# EasyEDA Pro project ProPrj_Rak11310v3b_2025-04-18.epro, board PCB1
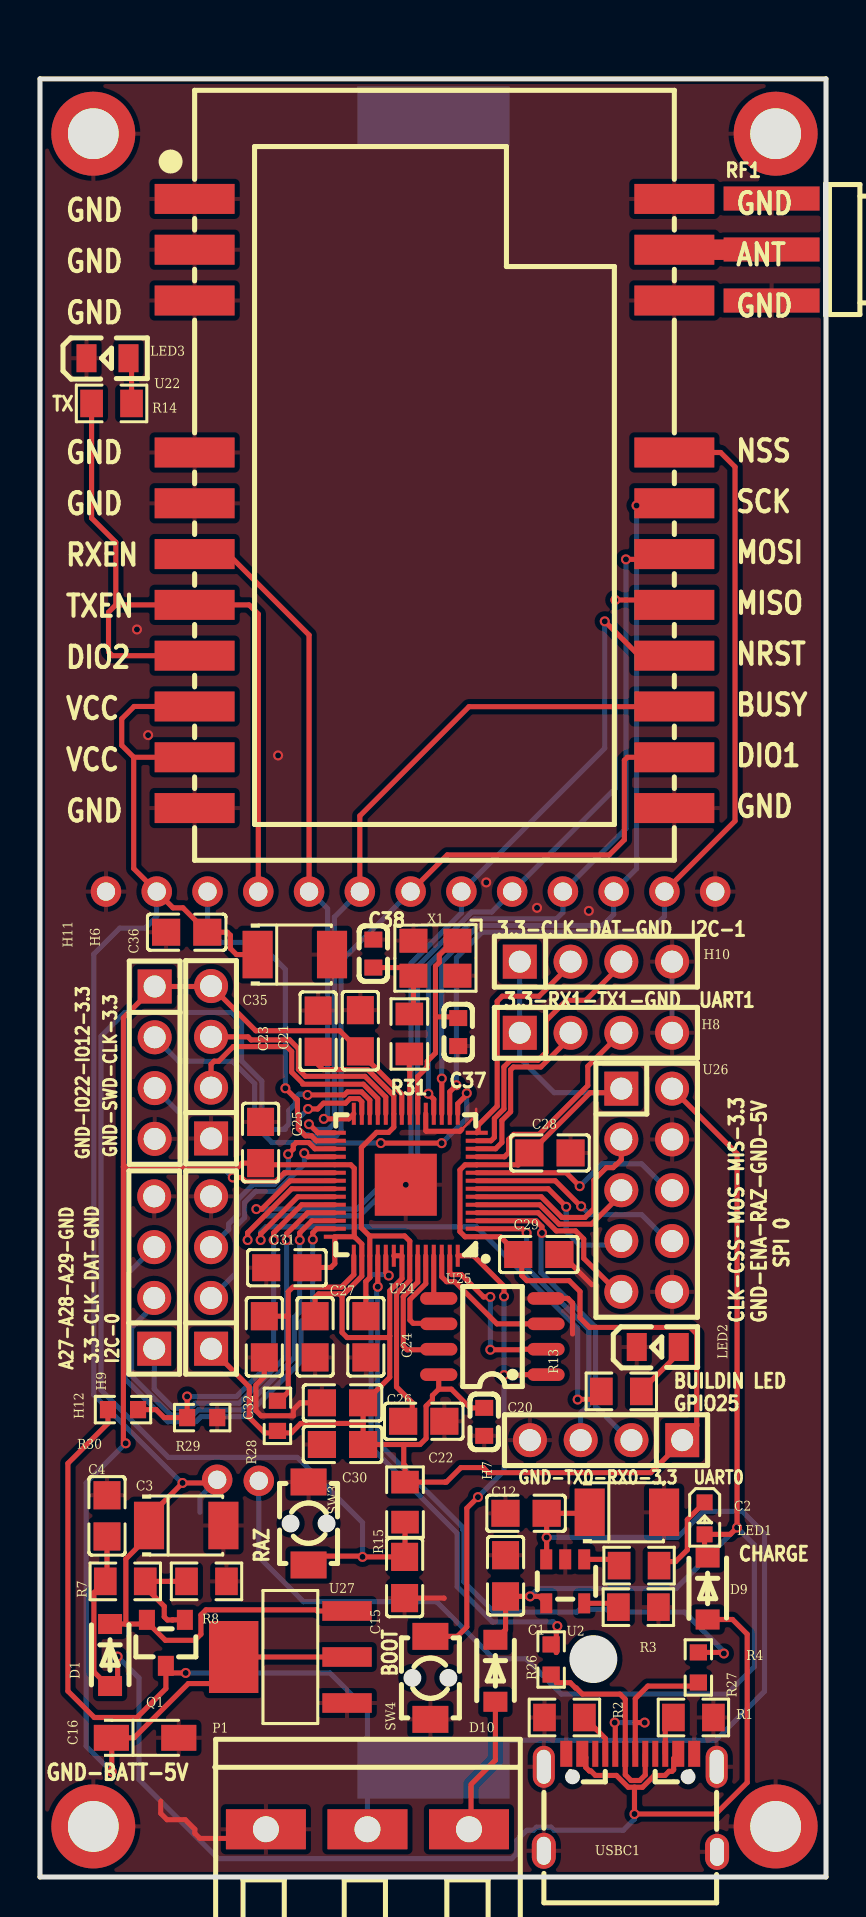
[diagram p1: board, top side]
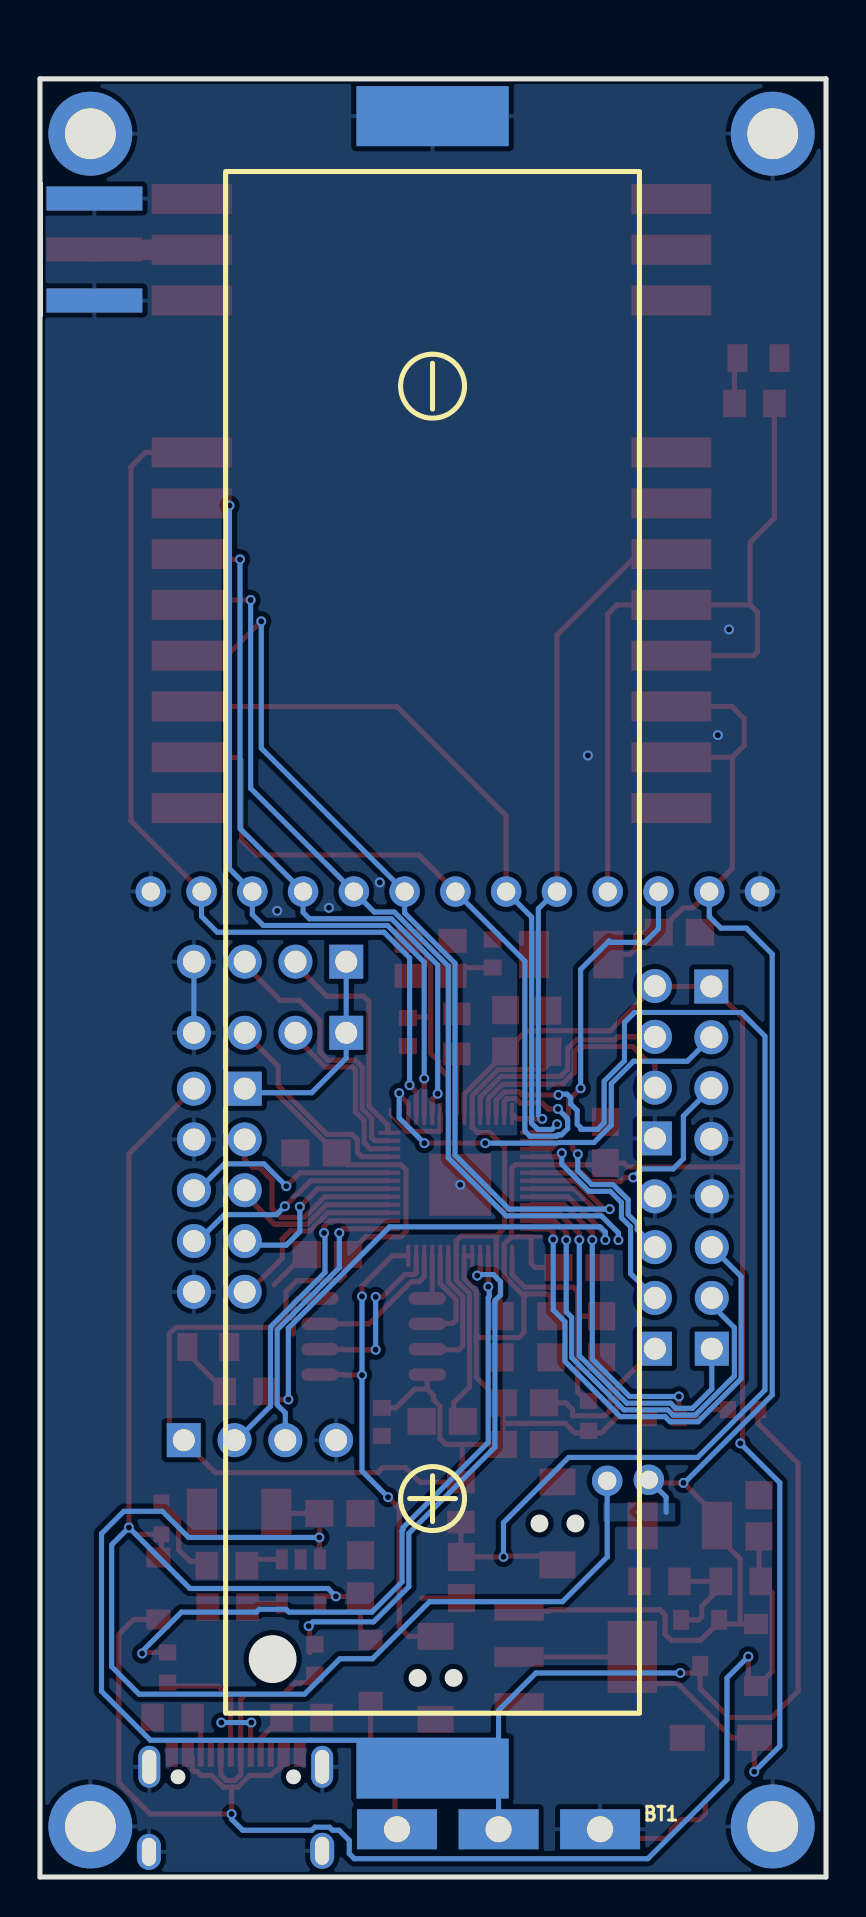
[diagram p2: board, bottom side, seen from below]

Outline 39.32 x 89.92 mm; copper layers: Top Layer, Bottom Layer. Coordinates in mm from the lower left corner of the outline.
Outline path: 0,89.92 0,0 39.32,0 39.32,89.92 0,89.92
Stack: Top Layer 0.035mm / Dielectric1 1.51mm FR4 er 4.5 / Bottom Layer 0.035mm

## Design rules (mm)
template: Custom Config
spacing copperThickness1oz (default): track to track 0.08, other pairs 0.08 to 0.3
spacing copperThickness2oz: track to track 0.203, other pairs 0.152 to 0.3
track width copperThickness1oz (default): min 0.08, default 0.254, max 2.54
track width copperThickness2oz: min 0.203, default 0.254, max 2.54
differential pair differentialPair (default): width min 0.127, default 0.254, max 2.54; gap min 0.152, default 0.152
via viaSize (default): diameter min 0.5, default 0.61, max 10; hole min 0.3, default 0.305, max 6.3

## Placement (name value [footprint] x y rotation side)
BT1  BH-18650-B1BA002  [BATTERY-SMD_18650-1S-L77.1-W20.7-1]  19.69 46.74 0 bottom
C1  1uF  [C0805]  23.29 15.06 270 top
C2  100uF  [CASE-B_3528]  29.36 18.24 0 top
C3  100uF  [CASE-B_3528]  7.32 17.58 0 top
C4  1uF  [C0805]  3.35 18.06 270 top
C12  100nF  [C0805]  24.32 18.19 0 top
C15  100nF  [C0805]  18.24 14.98 90 top
C16  10uF  [CAP-SMD_L3.2-W1.6-RD-C7171]  5.26 6.96 0 top
C20  1uF  [C0603]  22.23 22.76 270 top
C21  100nF  [C0805]  16.03 42.32 270 top
C22  100nF  [C0805]  19.2 22.79 180 top
C23  100nF  [C0805]  13.92 42.29 270 top
C24  100nF  [C0805]  16.3 27.01 90 top
C25  100nF  [C0805]  11.04 36.73 270 top
C26  100nF  [C0805]  15.14 23.71 0 top
C27  100nF  [C0805]  13.76 27.01 90 top
C28  100nF  [C0805]  25.51 36.21 180 top
C29  100nF  [C0805]  24.95 31.13 180 top
C30  100nF  [C0805]  15.14 21.63 0 top
C31  100nF  [C0805]  12.35 30.47 0 top
C32  100nF  [C0805]  11.22 27.01 90 top
C35  100uF  [CASE-B_3528]  12.75 46.13 0 top
C36  100nF  [C0805]  7.34 47.24 180 top
C37  15pF  [C0603]  20.92 42.25 270 top
C38  15pF  [C0603]  16.68 46.17 270 top
D1  MBR140SFT1G  [SOD-123F_L2.8-W1.8-LS3.7-RD]  3.51 11.1 270 top
D9  MBR140SFT1G  [SOD-123F_L2.8-W1.8-LS3.7-RD]  33.4 14.43 270 top
D10  MBR140SFT1G  [SOD-123F_L2.8-W1.8-LS3.7-RD]  22.78 10.31 270 top
H6  PZ254V-11-04P  [HDR-TH_4P-P2.54-V-M]  8.56 40.74 90 top
H7  PZ254V-11-04P  [HDR-TH_4P-P2.54-V-M]  28.32 21.84 180 top
H8  PZ254V-11-04P  [HDR-TH_4P-P2.54-V-M]  27.81 42.22 0 top
H9  PZ254V-11-04P  [HDR-TH_4P-P2.54-V-M]  8.56 30.23 90 top
H10  PZ254V-11-04P  [HDR-TH_4P-P2.54-V-M]  27.81 45.77 0 top
H11  PZ254V-11-04P  [HDR-TH_4P-P2.54-V-M]  5.74 40.72 270 top
H12  PZ254V-11-04P  [HDR-TH_4P-P2.54-V-M]  5.72 30.23 90 top
LED1  KT-0603R  [LED0603-RD]  33.25 17.93 270 top
LED2  KT-0805G  [LED0805-R-RD]  30.91 26.5 0 top
LED3  KT-0805B  [LED0805-R-RD]  3.38 75.95 0 top
NOREF  -  [Pad_e1183]  31.24 49.28 0 top
NOREF#2  -  [Pad_e4089]  2.67 2.53 0 top
NOREF#3  -  [Pad_e1184]  33.78 49.28 0 top
NOREF#4  -  [Pad_e1176]  10.92 49.28 0 top
NOREF#5  -  [Pad_e1035]  8.38 49.28 0 top
NOREF#6  -  [Pad_e1180]  23.62 49.28 0 top
NOREF#7  -  [Pad_e1179]  21.08 49.28 0 top
NOREF#8  -  [Pad_e4088]  36.8 2.53 0 top
NOREF#9  -  [Pad_e4085]  2.67 87.17 0 top
NOREF#10  -  [Pad_e4087]  36.8 87.17 0 top
NOREF#11  -  [Pad_e3351]  10.95 19.81 0 top
NOREF#12  -  [Pad_e1182]  28.7 49.28 0 top
NOREF#13  -  [Pad_e1173]  3.3 49.28 0 top
NOREF#14  -  [Pad_e1181]  26.16 49.28 0 top
NOREF#15  -  [Pad_e1174]  5.84 49.28 0 top
NOREF#16  -  [Pad_e2962]  8.86 19.86 0 top
NOREF#17  -  [Pad_e1178]  18.54 49.28 0 top
NOREF#18  -  [Pad_e1177]  16 49.28 0 top
NOREF#19  -  [Pad_e1175]  13.46 49.28 0 top
P1  WJ500V-5.08-3P  [CONN-TH_3P-P5.00_WJ500V-5.08-3P]  16.38 2.39 0 top
Q1  AO3401A  [SOT-23_L2.9-W1.3-P1.90-LS2.4-BR]  6.3 11.71 90 top
R1  4.7kΩ  [R0805]  32.69 7.98 180 top
R2  4.7kΩ  [R0805]  26.24 7.98 0 top
R3  2.7kΩ  [R0805]  29.94 13.5 180 top
R4  1kΩ  [R0805]  29.97 15.57 0 top
R7  1kΩ  [R0805]  4.27 14.78 180 top
R8  10kΩ  [R0805]  8.33 14.78 180 top
R13  4.7kΩ  [R0805]  29.08 24.28 180 top
R14  4.7kΩ  [R0805]  3.58 73.69 180 top
R15  10kΩ  [R0805]  18.26 18.75 90 top
R26  27Ω  [R0603]  25.57 10.88 270 top
R27  27Ω  [R0603]  32.94 10.48 270 top
R28  200Ω  [R0603]  11.88 23.06 90 top
R29  100kΩ  [R0603]  8.12 22.97 0 top
R30  200kΩ  [R0603]  4.15 23.37 180 top
R31  1kΩ  [R0805]  18.48 42.16 90 top
RF1  BWSMA-KE-P001  [SMA-SMD_BWSMA-KE-P001]  36.6 81.38 0 top
SW3  TSA343G00D-250J2  [SW-SMD_L4.0-W2.9-P4.15-EH]  13.44 17.68 270 top
SW4  TSA343G00D-250J2  [SW-SMD_L4.0-W2.9-P4.15-EH]  19.53 9.96 90 top
U2  TP4054  [SOT-23-5_L2.9-W1.6-P0.95-LS2.8-BR]  26.28 14.78 90 top
U22  E22-900M30S  [WIRELM-SMD_E22-900M30S]  19.74 68.68 180 top
U24  RP2040  [LQFN-56_L7.0-W7.0-P0.4-EP]  18.3 34.62 180 top
U25  W25Q16JVSNIQ  [SOP-8_L4.9-W3.9-P1.27-LS6.0-BL]  22.63 27.03 90 top
U26  ZX-PZ2.54-2-5PZZ  [HDR-TH_10P-P2.54-V-M-R2-C5-S2.54]  30.35 34.34 270 top
U27  AMS1117-3.3  [SOT-223-4_L6.5-W3.5-P2.30-LS7.0-BR]  12.53 11 0 top
USBC1  918-418K2023S40001  [USB-C-SMD_TYPE-C-USB-17]  29.54 3.71 0 top
X1  12MHz  [OSC-SMD_4P-L3.2-W2.5-BL]  19.78 45.94 180 top

## Footprints (pads in the part's own frame, mm; a bottom-side part is the same pattern mirrored in y, then rotated)
BATTERY-SMD_18650-1S-L77.1-W20.7-1
  rect 7.62x3 smd: 1(0,-41.313) 2(0,41.313)
C0603
  rect 0.8x0.9 smd: 1(-0.7,0) 2(0.7,0)
C0805
  rect 1.41x1.35 smd: 1(-1.03,0) 2(1.03,0)
CAP-SMD_L3.2-W1.6-RD-C7171
  rect 1.758x1.296 smd: 1(-1.687,0) 2(1.687,0)
CASE-B_3528
  rect 1.506x2.376 smd: 1(-1.861,0) 2(1.861,0)
CONN-TH_3P-P5.00_WJ500V-5.08-3P
  rect 4x2 hole 1.3: 1(-5.08,0) 2(0,0) 3(5.08,0)
HDR-TH_4P-P2.54-V-M
  rect 1.7x1.7 hole 1.1: 1(-3.81,0)
  round 1.7 hole 1.1: 2(-1.27,0) 3(1.27,0) 4(3.81,0)
HDR-TH_10P-P2.54-V-M-R2-C5-S2.54
  rect 1.7x1.7 hole 1.1: 1(-5.08,-1.27)
  round 1.7 hole 1.1: 2(-5.08,1.27) 3(-2.54,-1.27) 4(-2.54,1.27) 5(0,-1.27) 6(0,1.27) 7(2.54,-1.27) 8(2.54,1.27) 9(5.08,-1.27) 10(5.08,1.27)
LED0603-RD
  rect 0.8x0.8 smd: 1(-0.799,0) 2(0.799,0)
LED0805-R-RD
  rect 1x1.399 smd: 1(1.05,0) 2(-1.05,0)
LQFN-56_L7.0-W7.0-P0.4-EP
  rect 1.1x0.2 smd: 1(-3.55,2.6) 2(-3.55,2.2) 3(-3.55,1.8) 4(-3.55,1.4) 5(-3.55,1) 6(-3.55,0.6) 7(-3.55,0.2) 8(-3.55,-0.2) 9(-3.55,-0.6) 10(-3.55,-1) 11(-3.55,-1.4) 12(-3.55,-1.8) 13(-3.55,-2.2) 14(-3.55,-2.6) 29(3.55,-2.6) 30(3.55,-2.2) 31(3.55,-1.8) 32(3.55,-1.4) 33(3.55,-1) 34(3.55,-0.6) 35(3.55,-0.2) 36(3.55,0.2) 37(3.55,0.6) 38(3.55,1) 39(3.55,1.4) 40(3.55,1.8) 41(3.55,2.2) 42(3.55,2.6)
  rect 0.2x1.1 smd: 15(-2.6,-3.55) 16(-2.2,-3.55) 17(-1.8,-3.55) 18(-1.4,-3.55) 19(-1,-3.55) 20(-0.6,-3.55) 21(-0.2,-3.55) 22(0.2,-3.55) 23(0.6,-3.55) 24(1,-3.55) 25(1.4,-3.55) 26(1.8,-3.55) 27(2.2,-3.55) 28(2.6,-3.55) 43(2.6,3.55) 44(2.2,3.55) 45(1.8,3.55) 46(1.4,3.55) 47(1,3.55) 48(0.6,3.55) 49(0.2,3.55) 50(-0.2,3.55) 51(-0.6,3.55) 52(-1,3.55) 53(-1.4,3.55) 54(-1.8,3.55) 55(-2.2,3.55) 56(-2.6,3.55)
  rect 3.1x3.1 smd: 57(0,0)
OSC-SMD_4P-L3.2-W2.5-BL
  rect 1.4x1.2 smd: 1(-1.1,-0.875) 2(1.1,-0.875) 3(1.1,0.875) 4(-1.1,0.875)
Pad_e1035
  round 1.524 hole 0.914: 1(0,0)
Pad_e1173
  round 1.524 hole 0.914: 1(0,0)
Pad_e1174
  round 1.524 hole 0.914: 2(0,0)
Pad_e1175
  round 1.524 hole 0.914: 3(0,0)
Pad_e1176
  round 1.524 hole 0.914: 4(0,0)
Pad_e1177
  round 1.524 hole 0.914: 5(0,0)
Pad_e1178
  round 1.524 hole 0.914: 6(0,0)
Pad_e1179
  round 1.524 hole 0.914: 7(0,0)
Pad_e1180
  round 1.524 hole 0.914: 8(0,0)
Pad_e1181
  round 1.524 hole 0.914: 9(0,0)
Pad_e1182
  round 1.524 hole 0.914: 10(0,0)
Pad_e1183
  round 1.524 hole 0.914: 11(0,0)
Pad_e1184
  round 1.524 hole 0.914: 12(0,0)
Pad_e2962
  round 1.524 hole 0.914: 1(0,0)
Pad_e3351
  round 1.524 hole 0.914: 1(0,0)
Pad_e4085
  round 4.2 hole 2.54: 45(0,0)
Pad_e4087
  round 4.2 hole 2.54: 45(0,0)
Pad_e4088
  round 4.2 hole 2.54: 45(0,0)
Pad_e4089
  round 4.2 hole 2.54: 45(0,0)
R0603
  rect 0.806x0.864 smd: 1(-0.753,0) 2(0.753,0)
R0805
  rect 1.133x1.377 smd: 1(-1,0) 2(1,0)
SMA-SMD_BWSMA-KE-P001
  rect 4.8x1.2 smd: 1(0,-2.55) 2(0,2.55) 5(0,0)
  rect 4.8x1.2 smd far side: 3(0,2.55) 4(0,-2.55)
SOD-123F_L2.8-W1.8-LS3.7-RD
  rect 1x1.2 smd: 1(-1.55,0) 2(1.55,0)
SOP-8_L4.9-W3.9-P1.27-LS6.0-BL
  oval 0.63x1.865 smd: 1(-1.905,-2.683) 2(-0.635,-2.683) 3(0.635,-2.683) 4(1.905,-2.683) 5(1.905,2.683) 6(0.635,2.683) 7(-0.635,2.683) 8(-1.905,2.683)
SOT-23-5_L2.9-W1.6-P0.95-LS2.8-BR
  rect 1x0.6 smd: 1(1.1,-0.95) 2(1.1,0) 3(1.1,0.95) 4(-1.1,0.95) 5(-1.1,-0.95)
SOT-23_L2.9-W1.3-P1.90-LS2.4-BR
  rect 1x0.8 smd: 1(1.15,-0.95) 2(1.15,0.95) 3(-1.15,0)
SOT-223-4_L6.5-W3.5-P2.30-LS7.0-BR
  rect 2.47x0.98 smd: 1(2.835,-2.3) 2(2.835,0) 3(2.835,2.3)
  rect 2.47x3.6 smd: 4(-2.835,0)
SW-SMD_L4.0-W2.9-P4.15-EH
  rect 1.35x1.8 smd: 1(-2.075,0) 2(2.075,0)
USB-C-SMD_TYPE-C-USB-17
  oval 1.1x2.1 hole 0.7x1.7: 0(-4.334,1.802) 0(4.316,1.802)
  oval 1.2x1.8 hole 0.7x1.4: 0(-4.334,-2.398) 0(4.334,-2.453)
  rect 0.6x1.3 smd: A1(-3.209,2.451) A4(-2.409,2.451) A9(2.391,2.452) A12(3.191,2.451)
  rect 0.3x1.3 smd: A5(-1.259,2.451) A6(-0.259,2.451) A7(0.241,2.451) A8(1.24,2.453) B5(1.741,2.451) B6(0.741,2.451) B7(-0.759,2.451) B8(-1.759,2.453)
WIRELM-SMD_E22-900M30S
  rect 4x1.5 smd: 1(12,-15.23) 2(12,-12.69) 3(12,-10.15) 4(12,-2.55) 5(12,-0.01) 6(12,2.53) 7(12,5.07) 8(12,7.61) 9(12,10.15) 10(12,12.69) 11(12,15.23) 12(-12,15.23) 13(-12,12.69) 14(-12,10.15) 15(-12,7.61) 16(-12,5.07) 17(-12,2.53) 18(-12,-0.01) 19(-12,-2.55) 20(-12,-10.15) 21(-12,-12.69) 22(-12,-15.23)

## Nets
1V1: C22.2 C23.2 C24.2 U24.23 U24.45 U24.50
3.3V: C16.1 C20.1 C21.2 C25.2 C26.2 C27.2 C28.2 C29.2 C30.2 C31.2 H6.4 H7.1 H8.1 H9.1 H10.1 H11.1 R15.2 R28.1 U24.1 U24.10 U24.22 U24.33 U24.42 U24.44 U24.48 U24.49 U25.8 U26.1 U27.2 U27.4
+5V: C1.2 D9.1 D10.1 LED1.2 NOREF#11.1 U2.4 U26.2
GND: BT1.1 C1.1 C2.2 C3.2 C4.1 C12.1 C15.1 C16.2 C20.2 C21.1 C22.1 C23.1 C24.1 C25.1 C26.1 C27.1 C28.1 C29.1 C30.1 C31.1 C32.1 C35.2 C36.2 C37.2 C38.1 H6.1 H7.4 H8.4 H9.4 H10.4 H11.4 H12.4 LED2.2 LED3.2 NOREF#2.45 NOREF#3.12 NOREF#8.45 NOREF#9.45 NOREF#10.45 NOREF#13.1 P1.1 R1.1 R2.1 R3.1 R8.1 R29.2 RF1.1 RF1.2 RF1.3 RF1.4 SW3.1 SW4.1 U2.2 U22.1 U22.2 U22.3 U22.4 U22.5 U22.11 U22.12 U22.20 U22.22 U24.19 U24.57 U25.4 U26.4 U26.10 U27.1 USBC1.0 USBC1.A1 USBC1.A12 X1.2 X1.4
VCC: C3.1 C35.1 C36.1 D1.1 NOREF#15.2 NOREF#16.1 Q1.2 U22.9 U22.10 U27.3
ADC1-GPIO27: H12.1 U24.39
ADC2-GPIO28: H12.2 U24.40
ADC3-GPIO29: H12.3 U24.41
BUSY: NOREF#18.5 U22.14 U24.29
DIO1: NOREF#17.6 U22.13 U24.27
GPIO12: H11.2 U24.15
GPIO19: NOREF#5.1 U24.30
GPIO22: H11.3 U24.34
I2C0-CLK: H9.2 U24.32
I2C0-DAT: H9.3 U24.31
I2C1-CLK: H10.2 U24.14
I2C1-DAT: H10.3 U24.13
LED1: R13.2 U24.37
MISO: NOREF#6.8 U22.16 U24.36
MOSI: NOREF#14.9 U22.17 U24.18
NRST: NOREF#7.7 U22.15 U24.35
NSS: NOREF.11 U22.19 U24.16
QSPI_SCLK: U24.52 U25.6
QSPI_SD0: U24.53 U25.5
QSPI_SD1: U24.55 U25.2
QSPI_SD2: U24.54 U25.3
QSPI_SD3: U24.51 U25.7
QSPI_SS_N: SW4.2 U24.56 U25.1
RESET: C15.2 R15.1 SW3.2 U24.26
RXEN: NOREF#19.3 U22.6 U24.28
SCK: NOREF#12.10 U22.18 U24.17
SPI0-CLK: U24.4 U26.9
SPI0-CS-SS: U24.7 U26.7
SPI0-ENABLE: U24.8 U26.8
SPI0-MISO-RX: U24.6 U26.3
SPI0-MOSI-TX: U24.5 U26.5
SPI0-RESET: U24.9 U26.6
TXEN: NOREF#4.4 R14.2 U22.7 U22.8
UART0-RX: H7.2 U24.3
UART0-TX: H7.3 U24.2
UART1-RX: H8.2 U24.12
UART1-TX: H8.3 U24.11
USB+: R26.2 USBC1.A6 USBC1.B6
USB-: R27.2 USBC1.A7 USBC1.B7
VUSB: C4.2 D1.2 D9.2 R7.2 USBC1.A4 USBC1.A9
$2N12498: C37.1 U24.20 X1.1
$2N12725: R26.1 U24.47
$2N12727: R27.1 U24.46
$2N13721: C32.2 R28.2 U24.43
$2N13936: H6.2 U24.25
$2N13938: H6.3 U24.24
$2N15293: R29.1 R30.1 U24.38
$2N20056: R2.2 USBC1.A5
$2N20057: R1.2 USBC1.B5
$2N20240: LED3.1 R14.1
$2N20242: LED2.1 R13.1
$2N21416: R4.1 U2.1
$2N21417: LED1.1 R4.2
$2N21420: Q1.1 R7.1 R8.2
$2N21421: R3.2 U2.5
$2N21422: BT1.2 C2.1 C12.2 P1.2 Q1.3 R30.2 U2.3
$2N21423: D10.2 P1.3
$2N36053: C38.2 R31.2 X1.3
$2N36055: R31.1 U24.21
$2N36215: RF1.5 U22.21

Pads without a net: USBC1 A8 B8

## Via types
v1: diameter 0.5, hole 0.3, Top Layer to Bottom Layer, 60 vias

## Routing (per net, layer and track width the routed paths; a pad name or vN(x,y) marks a point on that pad's centre or on a via; arc(x,y) is an arc through that point)
1V1: length 28.7
  Top Layer w0.256: 18.63,22.79 18.63,23.72 17.84,24.51 17.84,29.17 18.5,29.84 U24.50 18.5,31.8 18.24,32.06 16.5,32.06 ; C24.2 16.3,29.77 16.5,29.97 U24.45 16.5,32.06 ; 16.5,32.06 16.48,32.06 16.08,32.46 16.08,36.47 16.84,37.24 17.44,37.24 17.7,37.49 U24.23 17.7,39.07 16.4,40.37 14.16,40.37 13.83,40.71 ; 13.83,41.26 13.92,41.26
3.3V: length 192.5
  Top Layer w0.256: 16.17,22.68 C26.2 16.22,23.71 17.5,24.99 17.5,27.05 ; 16.17,22.68 C30.2 18.2,21.63 ; 16.17,22.68 13.04,22.68 12.57,22.21 11.25,22.21 10.46,23 10.47,23.01 10.47,24.51 H9.1 ; C31.2 13.39,30.48 14.55,30.48 14.75,30.68 U24.42 15.73,32.02 ; 18.2,21.63 19.01,21.63 19.32,21.93 19.32,23.55 19.63,23.87 19.63,24.08 19.95,24.39 ; 18.2,21.63 18.2,20.63 18.26,20.57 R15.2 20.27,19.75 20.27,19.75 20.33,19.75 21.06,20.47 22.17,20.47 22.17,20.48 22.43,20.22 30.56,20.22 31.67,21.34 31.67,21.39 32.86,22.57 32.86,27.15 32.53,27.48 27.5,27.48 27.02,27.96 27.02,29.28 26.47,29.82 24.36,29.82 24.1,30.07 24.1,30.95 23.04,32.02 U24.1 21.27,32.02 21.01,32.27 21.01,35.36 21.27,35.61 21.85,35.61 U24.10 23.91,35.62 23.92,35.6 ; C28.2 24.51,36.21 27.52,39.22 29.08,39.22 ; 16.03,40.73 16.52,40.73 18.1,39.15 U24.22 ; C27.2 13.76,28.98 13.94,29.16 14.98,29.16 ; 4.17,35.51 9.92,35.51 10.11,35.7 C25.2 ; 4.17,35.51 4.17,21.8 v1(4.29,21.69) ; 4.17,35.51 4.17,42.96 H11.1 8.54,44.53 H6.4 10.8,42.32 15,42.32 C21.2 ; C20.1 21.52,23.46 20.58,24.39 19.95,24.39 ; 19.95,24.39 U25.8 ; 14.98,29.16 15.21,29.16 16.1,30.05 U24.44 16.1,31.65 15.73,32.02 ; 14.98,29.16 15.11,29.02 15.11,27.23 15.37,26.98 17.42,26.98 17.5,27.05 ; 17.5,27.05 17.5,29.31 18.11,29.92 18.11,31.07 U24.48 ; 15.73,32.02 15.72,32.03 15.72,35.44 15.55,35.62 U24.33 11.42,35.62 11.09,35.95 ; U27.2 U27.4 9.69,10.02 9.34,9.67 7.42,9.67 4.71,6.96 C16.1 3.59,6.94 v1(3.59,5.26)
  Bottom Layer w0.256: 29.08,39.22 25.73,39.22 24,40.95 H8.1 24,45.62 ; v1(3.59,5.26) 2.31,6.54 2.31,19.71 v1(4.29,21.69)
+5V: length 82.2
  Top Layer w0.256: D10.1 23.29,12.37 C1.2 v1(24.52,14.03) 24.98,14.03 U2.4 ; U26.2 34.87,36.17 v1(34.87,17.48) 34.53,17.13 LED1.2 33.25,15.72 33.3,15.67
  Bottom Layer w0.256: v1(24.52,14.03) 24.92,14.43 31.83,14.43 v1(34.87,17.48) 35.74,16.61 35.74,10.52 34.37,9.14 26.09,9.14 24.32,10.91 22.69,10.91 19.84,13.77 13.18,13.77 10.95,16 NOREF#11.1
GND: length 25.9
  Top Layer w0.128: 21.11,37.39 21.82,38.1 21.82,38.41
  Top Layer w0.256: C32.1 11.22,25.02 10.81,24.6 10.81,23.32 11.06,23.06 12.67,23.06 12.67,23.37 13.02,23.71 C26.1 ; 6.04,3.79 6.04,3.18 6.36,2.86 7.27,2.86 7.75,2.39 7.75,2.18 8,1.93 9.38,1.93 ; 27.61,29.62 26.1,31.13 C29.1 ; 21.11,37.39 21.01,37.29 19.33,37.29 19.3,37.32 U24.19 ; 20.22,13.94 20.21,13.95 C15.1 ; U25.4 26.42,28.93 26.64,28.7 26.64,27.15
  Bottom Layer w0.256: 31.62,45.62 H8.4
  vias: v1(4.85,62.38) v1(5.41,57.1) v1(11.91,56.08) v1(18.3,34.62) v1(22.33,49.73) v1(24.87,48.46) v1(27.46,48.31)
VCC: length 82.3
  Top Layer w0.256: 5.51,49.28 5.51,49.61 4.69,50.43 4.69,55.99 ; 5.45,17.63 5.45,18.03 v1(7.13,19.7) 8.6,19.7 8.82,19.92 8.82,19.91 NOREF#16.1 ; 5.45,17.63 C3.1 ; 5.45,17.63 5.16,17.63 4.98,17.45 4.98,16.58 4.3,15.9 4.3,12.65 ; U22.9 4.71,58.53 4.09,57.91 4.09,56.59 4.69,55.99 ; U27.3 13.87,13.3 13.81,13.36 8.31,13.36 8.05,13.11 8.05,12.14 7.75,11.84 6.27,11.84 5.35,12.76 Q1.2 5.14,12.65 4.3,12.65 ; C35.1 9.83,46.13 9.52,46.43 9.52,47.09 9.37,47.24 C36.1 7.15,48.46 6.66,48.46 NOREF#15.2 ; 4.69,55.99 7.74,55.99 ; D1.1 4.3,12.65
  Bottom Layer w0.256: NOREF#16.1 8,19 8,18.24 ; NOREF#15.2 5.84,48.03 5.26,47.45 3.99,47.45 2.69,46.15 2.69,24.11 7.11,19.69
ADC1-GPIO27: length 19.1
  Top Layer w0.256: v1(12.34,31.85) 12.34,32.17 13.39,33.22 U24.39
  Bottom Layer w0.256: H12.1 5.72,24.4 6.68,23.44 7.52,23.44 7.78,23.69 9.97,23.69 12.34,26.07 v1(12.34,31.85)
ADC2-GPIO28: length 22.9
  Top Layer w0.256: v1(13,31.85) 13,32.21 13.6,32.82 U24.40
  Bottom Layer w0.256: 5.72,28.96 5.72,28.6 4.58,27.47 4.58,25.06 6.54,23.1 7.66,23.1 7.92,23.36 10.11,23.36 12.73,25.97 12.73,27.99 13,28.26 v1(13,31.85)
ADC3-GPIO29: length 26
  Top Layer w0.256: v1(13.65,31.88) 13.65,32.22 13.85,32.42 U24.41
  Bottom Layer w0.256: v1(13.65,31.88) 13.65,28.36 13.06,27.77 13.06,25.79 10.3,23.02 8.05,23.02 7.8,22.76 6.4,22.76 4.25,24.92 4.25,30.03 H12.3
BUSY: length 36.6
  Top Layer w0.256: 31.44,58.52 21.46,58.52 16,53.06 NOREF#18.5 ; U24.29 13.9,37.22 13.47,37.64 v1(13.45,37.64)
  Bottom Layer w0.256: NOREF#18.5 14.73,48 14.73,37.69 14.42,37.38 13.72,37.38 v1(13.45,37.64)
DIO1: length 38.9
  Top Layer w0.256: v1(13.41,38.41) 13.89,38.41 14.18,38.7 15.29,38.7 15.51,38.92 15.95,38.92 16.1,38.77 U24.27 ; NOREF#17.6 20.37,51.11 28.48,51.11 29.24,51.87 29.24,55.84 29.39,55.99 31.74,55.99
  Bottom Layer w0.256: NOREF#17.6 15.06,45.8 15.06,37.3 14.81,37.05 13.48,37.05 13.41,37.11 13.24,37.11 12.92,37.42 12.92,37.86 12.94,37.88 12.94,37.94 v1(13.41,38.41)
GPIO12: length 21.9
  Top Layer w0.256: v1(17.05,36.7) 20.09,36.7 v1(20.09,36.7) ; v1(21.35,39.19) 21.35,39.12 20.9,38.67 20.9,38.17
  Bottom Layer w0.256: v1(21.35,39.19) 21.35,37.96 v1(20.09,36.7) ; H11.2 6.94,40.79 9.63,40.79 10.74,39.68 10.74,37.59 11.61,36.73 13.36,36.73 ; v1(17.05,36.7) 13.47,36.7
GPIO19: length 17
  Top Layer w0.256: U24.30 13.83,36.82 13.58,37.06 13.29,37.06 12.92,37.42 12.92,38.14 12.88,38.19 12.88,38.86 12.86,38.89 12.83,38.89 v1(12.28,39.44)
  Bottom Layer w0.256: NOREF#5.1 8.38,47.42 9.07,46.74 10.77,46.74 10.85,46.81 12.28,45.38 v1(12.28,39.44)
GPIO22: length 12.4
  Top Layer w0.256: U24.34 12.23,35.22 11.8,34.79 10.27,34.79 10.08,34.98 v1(9.65,34.98)
  Bottom Layer w0.256: v1(9.65,34.98) 9.22,35.41 7.65,35.41 7.14,35.92 7.14,38.05 H11.3
I2C0-CLK: length 11.4
  Top Layer w0.256: U24.32 13.4,36.02 v1(13.22,36.2)
  Bottom Layer w0.256: v1(13.22,36.2) 13.22,35.65 11.86,34.29 10.8,34.29 10.24,33.73 10.24,32.97 9.78,32.51 9.78,30.18 8.56,28.96
I2C0-DAT: length 9.7
  Top Layer w0.256: v1(12.42,36.15) 12.67,36.4 12.67,36.58 12.82,36.73 13.44,36.73 13.75,36.42 U24.31
  Bottom Layer w0.256: H9.3 9.44,32.38 9.44,32.66 9.9,33.12 9.9,33.87 10.66,34.63 11.72,34.63 12.42,35.32 12.42,36.14 v1(12.42,36.15)
I2C1-CLK: length 11.4
  Top Layer w0.256: 26.54,45.62 24.97,44.04 23.13,44.04 22.87,43.79 22.87,38.55 21.92,37.59 21.92,37.29 U24.14
I2C1-DAT: length 13.6
  Top Layer w0.256: U24.13 22.57,36.82 22.73,36.98 22.73,37.93 23.21,38.41 23.21,40.51 23.55,40.84 24.92,40.84 25.32,41.25 25.32,42.82 26.34,43.84 27.3,43.84 29.08,45.62
LED1: length 27.6
  Top Layer w0.256: 27.66,23.89 26.91,23.89 v1(26.9,23.88) ; U24.37 12.9,34.02 11.04,32.15 v1(11.04,31.85)
  Bottom Layer w0.256: v1(11.04,31.85) 11.04,32.25 11.3,32.51 21.83,32.51 26.9,27.45 v1(26.9,23.88)
MISO: length 51.7
  Top Layer w0.256: 31.74,63.61 31.49,63.86 v1(28.79,63.86) ; U24.36 12.59,34.42 10.39,32.21 v1(10.39,31.85)
  Bottom Layer w0.256: v1(28.79,63.86) 28.79,54.44 NOREF#6.8 22.6,48.25 21.6,48.25 18.9,45.55 18.9,35.96 16,33.06 11.24,33.06 10.39,32.21 v1(10.39,31.85)
MOSI: length 36.9
  Top Layer w0.256: v1(19.43,39.17) 19.7,38.89 U24.18 ; U22.17 31.47,65.89 v1(29.32,65.89)
  Bottom Layer w0.256: v1(19.43,39.17) 19.43,45.6 21.74,47.92 25.84,47.92 26.16,48.24 NOREF#14.9 29.32,52.43 v1(29.32,65.89)
NRST: length 48.3
  Top Layer w0.256: v1(10.82,33.4) 11.1,33.4 12.52,34.82 U24.35 ; v1(28.26,62.79) 29.97,61.07 31.74,61.07
  Bottom Layer w0.256: v1(10.82,33.4) 15.86,33.4 18.56,36.1 18.56,45.69 21.08,48.21 NOREF#7.7 28.26,56.45 v1(28.26,62.79)
NSS: length 46.5
  Top Layer w0.256: U22.19 34.05,71.23 34.77,70.51 34.77,52.81 NOREF.11 ; v1(20.83,39.59) 20.5,39.26 U24.16
  Bottom Layer w0.256: NOREF.11 31.24,48.03 30.45,47.24 22.11,47.24 20.83,45.96 v1(20.83,39.59)
QSPI_SCLK: length 4.3
  Top Layer w0.256: U24.52 19.3,29.67 18.51,28.88 18.51,27.85 18.67,27.69 19.18,27.69
QSPI_SD0: length 2.2
  Top Layer w0.256: U24.53 19.7,29.18 U25.5
QSPI_SD1: length 8.8
  Top Layer w0.256: U24.55 20.5,30.22 20.6,30.12 21.07,30.12 22.19,29.01 v1(22.53,29.01) ; v1(22.53,26.37) 24.1,26.37 24.13,26.39 U25.2
  Bottom Layer w0.256: v1(22.53,29.01) v1(22.53,26.37)
QSPI_SD2: length 7.2
  Top Layer w0.256: U24.54 20.1,30.01 20.35,29.77 20.75,29.77 22.86,27.66 U25.3
QSPI_SD3: length 5.8
  Top Layer w0.256: 19.13,26.37 18.36,26.37 18.17,26.56 18.17,29.02 18.9,29.75 18.9,31.07
QSPI_SS_N: length 24.9
  Top Layer w0.256: U25.1 24.13,25.12 24.1,25.1 v1(23.22,25.1) ; SW4.2 20.88,12.03 21.35,12.51 21.35,18.44 v1(21.91,19) ; 20.9,31.07 21.69,31.07 23.22,29.54 v1(23.22,29.03)
  Bottom Layer w0.256: v1(23.22,29.03) v1(23.22,25.1) 23.22,20.3 v1(21.91,19)
RESET: length 62.6
  Top Layer w0.256: R15.1 18.26,16.03 C15.2 v1(16.14,16.01) 16.1,16.05 13.59,16.05 ; U24.26 16.5,38.85 16.09,39.26 15.38,39.26 15.22,39.11 v1(13.39,39.11)
  Bottom Layer w0.256: v1(16.14,16.01) 16.14,17.72 12.88,20.98 6.43,20.98 3.05,24.35 3.05,42.04 4.24,43.23 9.58,43.23 10.08,42.72 10.08,40.81 11.1,39.79 11.1,37.71 11.42,37.39 12.27,37.39 12.27,37.46 12.45,37.64 12.45,38.33 12.78,38.66 12.78,38.96 12.96,39.15 13.35,39.15 v1(13.39,39.11)
RXEN: length 33.7
  Top Layer w0.256: v1(14.2,37.91) 15.45,37.91 U24.28 ; NOREF#19.3 13.46,62.1 9.41,66.15 U22.6
  Bottom Layer w0.256: NOREF#19.3 13.53,49.28 14.39,48.42 14.39,38.11 v1(14.2,37.91)
SCK: length 40
  Top Layer w0.256: 20.1,38.17 v1(20.1,39.93) ; v1(29.85,68.58) 31.62,68.58 31.74,68.69
  Bottom Layer w0.256: v1(29.85,68.58) 29.85,50.42 NOREF#12.10 28.7,48.13 28.15,47.58 21.94,47.58 20.1,45.74 v1(20.1,39.93)
SPI0-CLK: length 9.5
  Top Layer w0.256: 29.08,29.06 27.2,30.94 27.2,31.9 26.8,32.31 25.83,32.31 24.93,33.22 U24.4
SPI0-CS-SS: length 9.1
  Top Layer w0.256: U24.7 25.43,34.42 v1(26.33,33.52)
  Bottom Layer w0.256: 29.08,31.6 27,31.6 26.33,32.27 v1(26.33,33.52)
SPI0-ENABLE: length 11.1
  Top Layer w0.256: U24.8 25.77,34.82 27.05,33.54 v1(27.07,33.54)
  Bottom Layer w0.256: 31.62,31.6 30.1,33.12 27.49,33.12 v1(27.07,33.54)
SPI0-MISO-RX: length 10.5
  Top Layer w0.256: 29.08,36.68 29.08,35.87 28.83,35.61 28.81,35.61 28.67,35.47 28.33,35.47 27.71,34.85 27.71,33.43 27.27,32.98 26.11,32.98 25.08,34.02 U24.6
SPI0-MOSI-TX: length 8.3
  Top Layer w0.256: U24.5 25,33.62 25.97,32.65 27.59,32.65 29.08,34.14
SPI0-RESET: length 11.1
  Top Layer w0.256: v1(27,34.54) 26.33,35.22 U24.9
  Bottom Layer w0.256: 31.62,34.14 30.1,35.66 28.12,35.66 v1(27,34.54)
TXEN: length 38.7
  Top Layer w0.256: R14.2 2.58,67.95 3.79,66.74 3.79,63.61 ; 7.74,61.07 3.62,61.07 3.43,61.27 3.43,63.25 3.79,63.61 ; 3.79,63.61 10.46,63.61 10.92,63.15 NOREF#4.4
UART0-RX: length 16.1
  Top Layer w0.256: v1(25.11,32.2) 25.11,32.52 24.82,32.82 U24.3
  Bottom Layer w0.256: 29.59,21.74 27.79,23.54 27.79,27.5 25.06,30.23 25.06,32.15 v1(25.11,32.2)
UART0-TX: length 14.5
  Top Layer w0.256: U24.2 24.14,32.42 v1(24.35,32.2)
  Bottom Layer w0.256: v1(24.35,32.2) 24.35,30.47 27.46,27.36 27.46,23.62 27.05,23.21 27.05,21.74
UART1-RX: length 9.1
  Top Layer w0.256: U24.12 22.8,36.42 23.11,36.73 23.11,37.83 23.55,38.27 23.55,40.37 23.68,40.5 25.05,40.5 26.54,41.99 H8.2
UART1-TX: length 10.8
  Top Layer w0.256: H8.3 27.41,40.54 27.41,39.58 24.97,37.14 23.7,37.14 23.44,36.88 23.44,36.22 23.24,36.02 U24.11
USB+: length 9.9
  Top Layer w0.256: 25.83,9.72 26.53,9.72 26.8,9.45 26.83,9.45 27.13,9.14 29.02,9.14 29.28,8.88 29.28,5.11 29.57,4.83 30.01,4.83 30.28,5.1 30.28,6.16
USB-: length 9.8
  Top Layer w0.256: 29.78,7.72 29.78,8.92 30.41,9.55 32.76,9.55 R27.2 ; 29.78,7.72 v1(30.25,7.72) ; 29.78,7.72 29.78,6.16 ; 28.78,6.16 28.78,7.69 v1(28.75,7.72)
  Bottom Layer w0.256: v1(28.75,7.72) 30.25,7.72
VUSB: length 68.5
  Top Layer w0.256: 29.74,4.49 v1(29.74,3.15) 33.81,3.15 35.38,4.72 35.38,12.14 34.65,12.88 D9.2 ; 29.74,4.49 30.15,4.49 30.74,5.08 31.27,5.08 31.47,5.28 31.62,5.28 31.7,5.37 31.7,5.93 USBC1.A9 ; 29.74,4.49 29.43,4.49 28.84,5.08 27.78,5.08 27.56,5.3 27.48,5.3 27.3,5.48 27.3,5.99 27.13,6.16 ; C4.2 3.35,14.87 R7.2 2.7,14.21 2.7,10.26 3.41,9.55 D1.2 3.89,9.93 v1(3.89,11.02)
  Bottom Layer w0.256: v1(3.89,11.02) 4.95,9.96 4.95,4.88 8.92,0.91 23.6,0.91 23.85,1.17 23.85,1.83 24.36,2.34 24.69,2.34 24.84,2.49 25.57,2.49 25.72,2.34 29.18,2.34 29.74,2.9 v1(29.74,3.15)
$2N12498: length 10.7
  Top Layer w0.256: C37.1 20.86,43.01 19.79,43.01 ; 19.79,43.01 19.79,45.55 19.98,45.74 19.98,46.1 20.67,46.79 20.85,46.79 X1.1 ; 19.79,43.01 19.79,41.2 19.38,40.79 19.38,40.5 18.9,40.03 18.9,38.95 18.9,38.95 18.9,38.17
$2N12725: length 26.7
  Top Layer w0.256: v1(25.88,12.55) 25.83,12.5 25.83,11.23 25.83,11.22 ; v1(17.45,30.07) 17.3,30.22 U24.47
  Bottom Layer w0.256: v1(17.45,30.07) 17.4,30.12 16.64,30.12 16.28,29.77 16.28,29.11 16.56,28.83 16.56,21.49 20.87,17.18 20.87,14.52 22.63,12.76 25.67,12.76 v1(25.88,12.55)
$2N12727: length 34.1
  Top Layer w0.256: R27.1 34.16,11.23 v1(34.21,11.18) ; 16.9,31.07 v1(16.9,29.52)
  Bottom Layer w0.256: v1(34.21,11.18) 34.21,11.28 32.25,13.25 28.5,13.25 28.36,13.39 27.01,13.39 26.87,13.25 22.72,13.25 21.21,14.76 21.21,17.32 21.16,17.37 21.16,17.48 16.9,21.73 16.9,28.97 16.85,29.02 16.85,29.46 v1(16.9,29.52)
$2N13721: length 11.6
  Top Layer w0.256: 11.88,23.71 12.42,24.25 12.42,28.06 ; 12.42,28.06 12.42,29.27 12.65,29.5 15.08,29.5 15.7,30.12 U24.43 ; 12.42,28.06 12.41,28.04 C32.2
$2N13936: length 12.3
  Top Layer w0.256: H6.2 8.56,40.64 8.71,40.79 8.94,40.79 9.67,41.52 12.35,41.52 12.59,41.28 12.59,40.25 13.14,39.7 ; 13.14,39.64 16.18,39.64 16.9,38.92 16.9,38.17
$2N13938: length 11.4
  Top Layer w0.256: U24.24 17.3,39 16.26,40.04 13.28,40.04 12.93,40.39 12.93,41.42 12.49,41.86 10.56,41.86 10.41,42.01 H6.3
$2N15293: length 18.7
  Top Layer w0.254: R29.1 6.21,22.97 5.81,23.37 R30.1
  Top Layer w0.256: U24.38 13.09,33.62 11.69,32.21 v1(11.69,31.85) ; R29.1 v1(7.36,24.03)
  Bottom Layer w0.256: v1(7.36,24.03) 9.83,24.03 11.69,25.89 v1(11.69,31.85)
$2N20056: length 2.2
  Top Layer w0.256: 28.28,6.16 28.28,6.93 R2.2
$2N20057: length 2
  Top Layer w0.256: 31.28,6.16 31.28,7.57 R1.2
$2N20240: length 2.3
  Top Layer w0.256: R14.1 4.58,75.79 LED3.1
$2N20242: length 3
  Top Layer w0.256: LED2.1 31.96,26.19 30.22,24.45 30.22,24.23
$2N21416: length 1.7
  Top Layer w0.256: 28.92,15.77 28.81,15.88 U2.1
$2N21417: length 4.4
  Top Layer w0.256: 30.92,15.77 31.8,15.77 32.39,16.36 32.39,17.87 LED1.1
$2N21420: length 5.6
  Top Layer w0.256: Q1.1 6.64,12.86 6.63,12.85 6.37,12.85 6.22,13.01 6.22,13.54 5.06,14.69 5.16,14.78 R8.2
$2N21421: length 1.7
  Top Layer w0.256: 28.94,13.75 28.87,13.68 U2.5
$2N21422: length 84.1
  Top Layer w0.254: R30.2 3.4,22.69 1.4,20.68 1.4,9.3 2.72,7.98 4.85,7.98 6.3,9.42 Q1.3
  Top Layer w0.256: 6.3,10.2 v1(7.29,10.2) ; 27.5,18.34 27.35,18.19 C12.2 v1(25.35,16.98) 25.35,15.91 U2.3
  Bottom Layer w0.256: v1(7.29,10.2) 14.51,10.2 16.38,8.33 16.38,6.86 ; 16.38,6.86 P1.2 ; 16.38,6.86 16.4,6.84 33.8,6.84 36.25,9.29 36.25,17.17 35.13,18.29 33.2,18.29 31.89,16.98 v1(25.35,16.98)
$2N21423: length 6.9
  Top Layer w0.256: D10.2 22.78,5.84 21.56,4.62 21.56,2.49 P1.3
$2N36053: length 4.2
  Top Layer w0.256: R31.2 18.68,43.36 X1.3 18.28,45.47 C38.2
$2N36055: length 3
  Top Layer w0.256: U24.21 18.5,40.31 18.48,40.33 R31.1
$2N36215: length 4.9
  Top Layer w1.024: 36.6,81.28 36.51,81.37 U22.21

## Copper pours and planes (outline as drawn; the poured copper is in the pictures)
+5V on Bottom Layer: 9.42,18.69 11.15,18.69 11.15,17.78 9.42,17.78
GND on Top Layer: -0.94,90.78 41.73,90.78 41.73,-1.07 -0.94,-1.07
GND on Bottom Layer: -2.01,90.98 40.11,90.98 40.11,-2.13 -2.01,-2.13
VCC on Bottom Layer: 7.54,18.69 9.58,18.69 9.58,17.78 7.54,17.78

## Text on the board
Top Silkscreen Layer: GND-TX0-RX0-3.3  UART0 | A27-A28-A29-GND | GND-IO22-IO12-3.3 | GND-SWD-CLK-3.3 | 3.3-CLK-DAT-GND / I2C-0 | TX | 3.3-CLK-DAT-GND  I2C-1 | 3.3-RX1-TX1-GND  UART1 | BUILDIN LED / GPIO25 | CHARGE | RAZ | BOOT | CLK-CSS-MOS-MIS-3.3 / GND-ENA-RAZ-GND-5V / SPI 0 | GND-BATT-5V | GND | RXEN | TXEN | DIO2 | VCC | ANT | NSS | SCK | MOSI | MISO | NRST | BUSY | DIO1
